# EasyEDA Pro project ProPrj_FOC_AT32F413.epro, board PCB1_1
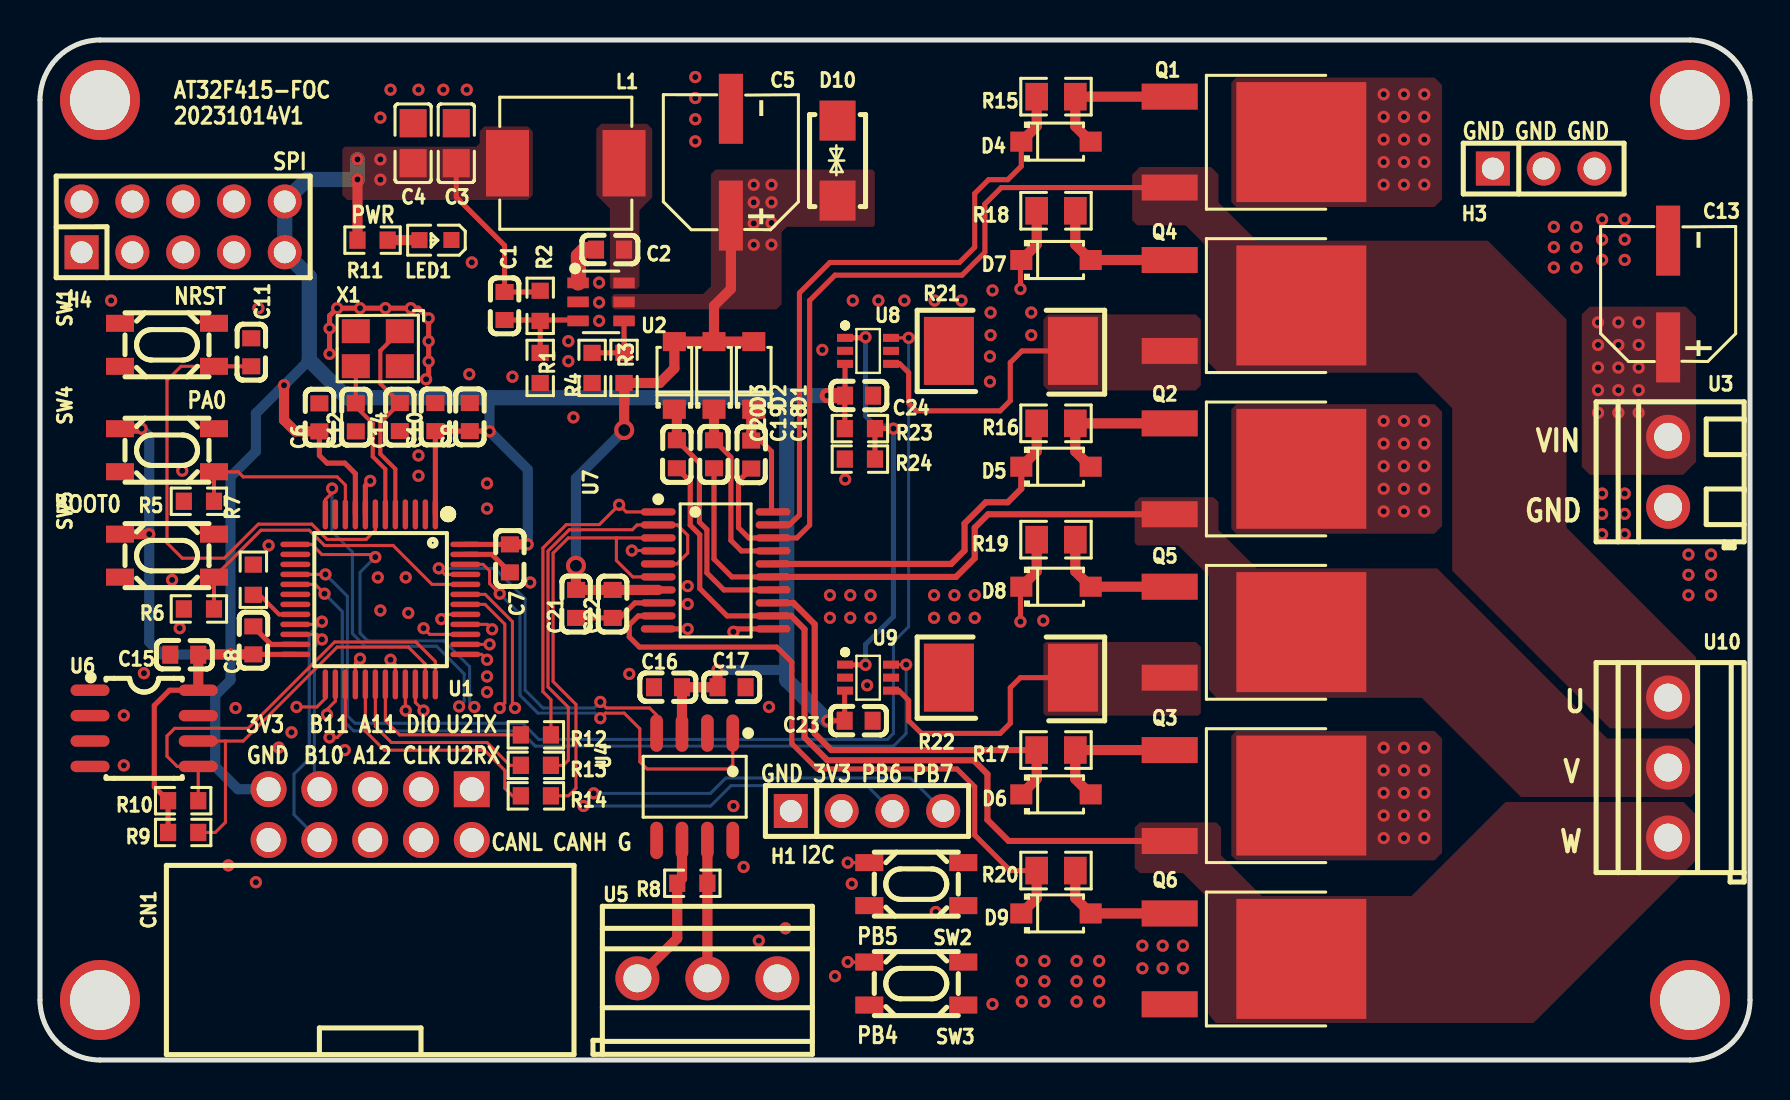
[diagram p11: board, top side]
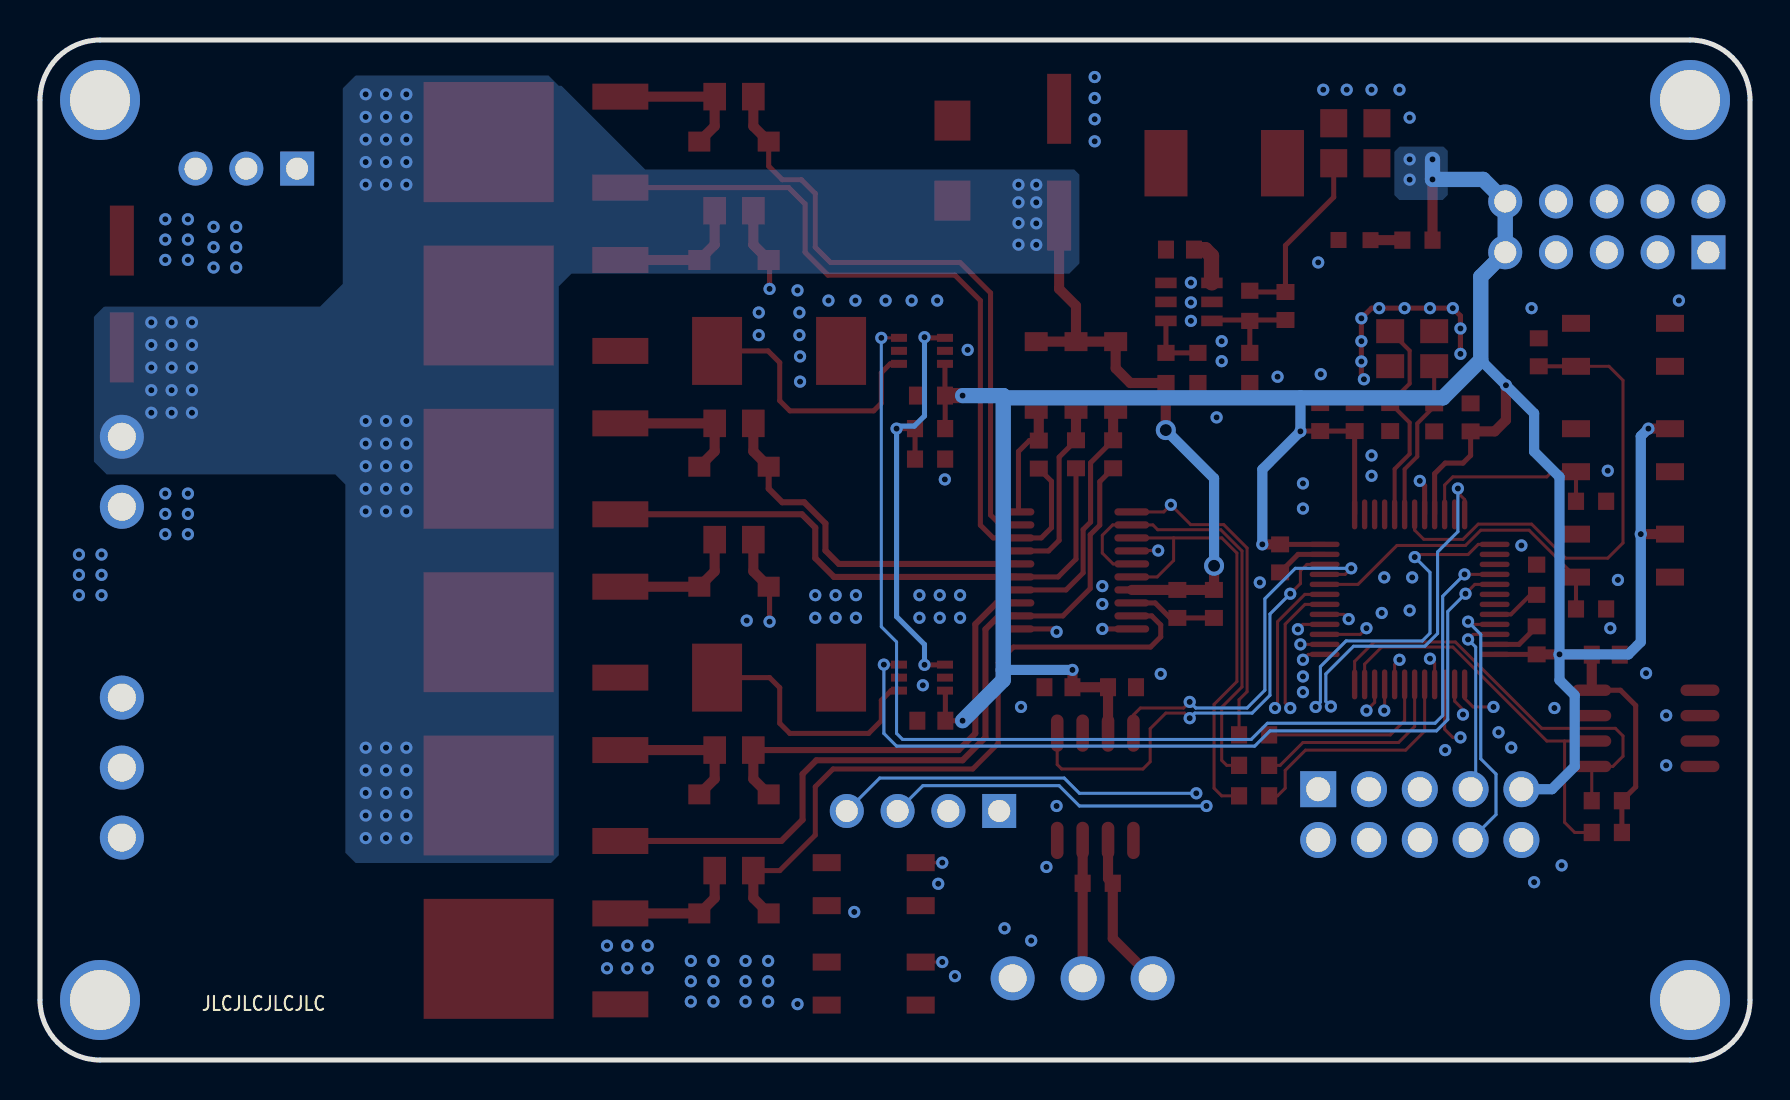
[diagram p12: board, bottom side, seen from below]

Outline 85.5 x 51 mm; copper layers: Top Layer, Inner1, Inner2, Bottom Layer. Coordinates in mm from the lower left corner of the outline.
Outline path: 0,48 0,3 arc(0.88,0.88) 3,0 82.5,0 arc(84.62,0.88) 85.5,3 85.5,48 arc(84.62,50.12) 82.5,51 3,51 arc(0.88,50.12) 0,48
Stack: Top Layer 0.035mm 外层铜厚1oz / Dielectric1 0.2104mm 7628 RC49% 8.6mil / Inner1 0.0152mm 内层铜厚 / Dielectric2 1.065mm 1.1mm H/HOZ 含铜 / Inner2 0.0152mm 内层铜厚 / Dielectric3 0.2104mm 7628 RC49% 8.6mil / Bottom Layer 0.035mm 外层铜厚1oz

## Design rules (mm)
template: 自定义配置
spacing copperThickness1oz (default): track to track 0.102, other pairs 0.152 to 0.3
spacing copperThickness2oz: track to track 0.203, other pairs 0.152 to 0.3
spacing copperThicknessInner0.5oz: track to track 0.089, other pairs 0.152 to 0.3
track width copperThickness1oz (default): min 0.102, default 0.254, max 2.54
track width copperThickness2oz: min 0.203, default 0.254, max 2.54
track width copperThickness0.5oz: min 0.089, default 0.254, max 2.54
differential pair differentialPair (default): width min 0.127, default 0.254, max 2.54; gap min 0.152, default 0.152
via viaSize (default): diameter min 0.3, default 0.61, max 10; hole min 0.201, default 0.305, max 6.299

## Placement (name value [footprint] x y rotation side)
C1  22pF  [C0603]  23.23 37.7 270 top
C2  22nF  [C0603]  28.5 40.52 0 top
C3  22uF  [C0805]  20.81 45.84 270 top
C4  22uF  [C0805]  18.66 45.84 270 top
C5  100uF  [CAP-SMD_BD6.3-L6.6-W6.6-LS7.2-FD]  34.54 44.89 90 top
C6  100nF  [C0603]  13.97 32.13 270 top
C7  100nF  [C0603]  23.5 25.08 90 top
C8  100nF  [C0603]  10.67 20.98 270 top
C9  1uF  [C0603]  21.49 32.15 270 top
C10  100nF  [C0603]  19.77 32.15 270 top
C11  100nF  [C0603]  10.56 35.39 270 top
C12  22pF  [C0603]  15.79 32.13 270 top
C13  100uF  [CAP-SMD_BD6.3-L6.6-W6.6-LS7.2-FD]  81.41 38.3 90 top
C14  22pF  [C0603]  17.99 32.15 90 top
C15  100nF  [C0603]  7.21 20.27 180 top
C16  10uF  [C0603]  31.4 18.64 0 top
C17  100nF  [C0603]  34.58 18.64 180 top
C18  100nF  [C0603]  35.56 30.27 90 top
C19  100nF  [C0603]  33.7 30.29 90 top
C20  100nF  [C0603]  31.84 30.29 90 top
C21  1uF  [C0603]  26.81 22.8 90 top
C22  100nF  [C0603]  28.63 22.8 90 top
C23  100nF  [C0603]  40.93 16.96 0 top
C24  100nF  [C0603]  40.95 33.22 0 top
CN1  Z-231012810106  [IDC-TH_Z-231012810106]  16.51 12.27 180 top
D1  DSK34  [SOD-123_L2.8-W1.8-LS3.7-RD]  35.69 34.23 90 top
D2  DSK34  [SOD-123_L2.8-W1.8-LS3.7-RD]  33.7 34.23 90 top
D3  DSK34  [SOD-123_L2.8-W1.8-LS3.7-RD]  31.72 34.23 90 top
D4  1N4148W  [SOD-123F_L2.7-W1.6-LS3.8-RD]  50.8 45.92 0 top
D5  1N4148W  [SOD-123F_L2.7-W1.6-LS3.8-RD]  50.8 29.66 0 top
D6  1N4148W  [SOD-123F_L2.7-W1.6-LS3.8-RD]  50.8 13.28 0 top
D7  1N4148W  [SOD-123F_L2.7-W1.6-LS3.8-RD]  50.8 40 0 top
D8  1N4148W  [SOD-123F_L2.7-W1.6-LS3.8-RD]  50.8 23.66 0 top
D9  1N4148W  [SOD-123F_L2.7-W1.6-LS3.8-RD]  50.8 7.33 0 top
D10  SMAJ12CA/TR13  [SMA_L4.4-W2.6-LS5.0-BI]  39.88 44.97 270 top
H1  X6511WV-04H-C60D30  [HDR-TH_4P-P2.54-V-M]  41.35 12.45 0 top
H3  X6511WV-03H-C30D60  [HDR-TH_3P-P2.54-V-M]  75.18 44.57 0 top
H4  PZ254-2-05-Z-8.5  [HDR-TH_10P-P2.54-V-M-R2-C5-S2.54]  7.16 41.66 0 top
L1  6.8uH  [IND-SMD_L7.1-W6.6]  26.29 44.84 180 top
LED1  XL-1608UBC-04  [LED0603-RD_BLUE]  19.77 41 180 top
NOREF  -  [Pad_e7601]  3 3 0 top
NOREF#2  -  [Pad_e7602]  3 48 0 top
NOREF#3  -  [Pad_e7600]  82.5 3 0 top
NOREF#4  -  [Pad_e67]  82.5 48 0 top
Q1  NCE3080K  [TO-252-2_L6.6-W6.1-P4.57-LS9.9-TL-CW]  59.78 45.89 0 top
Q2  NCE3080K  [TO-252-2_L6.6-W6.1-P4.57-LS9.9-TL-CW]  59.78 29.56 0 top
Q3  NCE3080K  [TO-252-2_L6.6-W6.1-P4.57-LS9.9-TL-CW]  59.78 13.22 0 top
Q4  NCE3080K  [TO-252-2_L6.6-W6.1-P4.57-LS9.9-TL-CW]  59.78 37.73 0 top
Q5  NCE3080K  [TO-252-2_L6.6-W6.1-P4.57-LS9.9-TL-CW]  59.78 21.39 0 top
Q6  NCE3080K  [TO-252-2_L6.6-W6.1-P4.57-LS9.9-TL-CW]  59.78 5.06 0 top
R1  22.1kΩ  [R0603]  25.01 34.6 270 top
R2  100kΩ  [R0603]  25.01 37.71 270 top
R3  20kΩ  [R0603]  29.2 34.6 270 top
R4  10kΩ  [R0603]  27.6 34.6 90 top
R5  10kΩ  [R0603]  7.95 27.94 0 top
R6  10kΩ  [R0603]  7.95 22.55 0 top
R7  10kΩ  [R0603]  10.67 24.01 270 top
R8  120Ω  [R0603]  32.62 8.84 180 top
R9  10kΩ  [R0603]  7.16 11.38 180 top
R10  10kΩ  [R0603]  7.16 12.97 180 top
R11  1kΩ  [R0603]  16.63 40.99 0 top
R12  100Ω  [R0603]  24.79 16.26 0 top
R13  100Ω  [R0603]  24.79 14.73 0 top
R14  100Ω  [R0603]  24.79 13.21 0 top
R15  10Ω  [R0805_NEW]  50.8 48.17 0 top
R16  10Ω  [R0805_NEW]  50.8 31.83 0 top
R17  10Ω  [R0805_NEW]  50.8 15.5 0 top
R18  10Ω  [R0805_NEW]  50.8 42.46 0 top
R19  10Ω  [R0805_NEW]  50.8 26.02 0 top
R20  10Ω  [R0805_NEW]  50.8 9.47 0 top
R21  5mΩ  [RES-SMD_L6.4-W3.2-1]  48.55 35.45 0 top
R22  5mΩ  [RES-SMD_L6.4-W3.2-1]  48.55 19.12 0 top
R23  1kΩ  [R0603]  41 31.57 0 top
R24  1kΩ  [R0603]  41 30.05 180 top
SW1  TS-1145A-B-A  [SW-SMD_4P-L4.2-W3.2-P2.15-LS5.2]  6.35 35.76 270 top
SW2  TS-1145A-B-A  [SW-SMD_4P-L4.2-W3.2-P2.15-LS5.2]  43.81 8.79 90 top
SW3  TS-1145A-B-A  [SW-SMD_4P-L4.2-W3.2-P2.15-LS5.2]  43.81 3.82 90 top
SW4  TS-1145A-B-A  [SW-SMD_4P-L4.2-W3.2-P2.15-LS5.2]  6.35 30.49 270 top
SW5  TS-1145A-B-A  [SW-SMD_4P-L4.2-W3.2-P2.15-LS5.2]  6.35 25.22 270 top
U1  AT32F415CBT7  [LQFP-48_L7.0-W7.0-P0.50-LS9.0-BL]  17.02 23.03 180 top
U2  MT2492  [SOT-23-6_L2.9-W1.6-P0.95-LS2.8-BL]  28.05 37.91 270 top
U3  KF128L-3.5-2P  [CONN-TH_P3.50_KF128L-3.5-2P]  81.41 29.41 90 top
U4  SIT65HVD230DR  [SOP-8_L4.9-W3.9-P1.27-LS6.0-BL]  32.73 13.66 180 top
U5  KF128L-3.5-3P  [CONN-TH_3P-P3.50_KF128L-3.5-3P]  33.37 4.08 0 top
U6  AT24C02C-SSHM-T  [SOIC-8_L5.0-W4.0-P1.27-LS6.0-BL]  5.21 16.58 270 top
U7  EG2133  [TSSOP-20_L6.5-W4.4-P0.65-LS6.4-BL]  33.78 24.48 270 top
U8  TP181A1-CR  [SC70-6_L2.1-W1.3-P0.65-LS2.3-BL]  41.4 35.46 270 top
U9  TP181A1-CR  [SC70-6_L2.1-W1.3-P0.65-LS2.3-BL]  41.4 19.12 270 top
U10  KF128L-3.5-3P  [CONN-TH_3P-P3.50_KF128L-3.5-3P]  81.41 14.62 90 top
X1  8MHz  [OSC-SMD_4P-L3.2-W2.5-BL]  16.89 35.57 180 top

## Footprints (pads in the part's own frame, mm; a bottom-side part is the same pattern mirrored in y, then rotated)
C0603
  rect 0.8x0.9 smd: 1(-0.7,0) 2(0.7,0)
C0805
  rect 1.41x1.35 smd: 1(-1,0) 2(1,0)
CAP-SMD_BD6.3-L6.6-W6.6-LS7.2-FD
  rect 3.5x1.2 smd: 1(-2.67,0) 2(2.67,0)
CONN-TH_3P-P3.50_KF128L-3.5-3P
  round 2.2 hole 1.4: 1(-3.5,0) 2(0,0) 3(3.5,0)
CONN-TH_P3.50_KF128L-3.5-2P
  round 2.2 hole 1.4: 1(-1.75,0) 2(1.75,0)
HDR-TH_3P-P2.54-V-M
  rect 1.7x1.7 hole 1.1: 1(-2.54,0)
  round 1.7 hole 1.1: 2(0,0) 3(2.54,0)
HDR-TH_4P-P2.54-V-M
  rect 1.7x1.7 hole 1.1: 1(-3.81,0)
  round 1.7 hole 1.1: 2(-1.27,0) 3(1.27,0) 4(3.81,0)
HDR-TH_10P-P2.54-V-M-R2-C5-S2.54
  rect 1.7x1.7 hole 1.1: 1(-5.08,-1.27)
  round 1.7 hole 1.1: 2(-5.08,1.27) 3(-2.54,-1.27) 4(-2.54,1.27) 5(0,-1.27) 6(0,1.27) 7(2.54,-1.27) 8(2.54,1.27) 9(5.08,-1.27) 10(5.08,1.27)
IDC-TH_Z-231012810106
  rect 1.8x1.8 hole 1.2: 1(-5.08,-1.27)
  round 1.8 hole 1.2: 2(-5.08,1.27) 3(-2.54,-1.27) 4(-2.54,1.27) 5(0,-1.27) 6(0,1.27) 7(2.54,-1.27) 8(2.54,1.27) 9(5.08,-1.27) 10(5.08,1.27)
IND-SMD_L7.1-W6.6
  rect 2.15x3.32 smd: 1(-2.913,0) 2(2.913,0)
LED0603-RD_BLUE
  rect 0.8x0.8 smd: 1(-0.799,-0.004) 2(0.799,0.004)
LQFP-48_L7.0-W7.0-P0.50-LS9.0-BL
  oval 0.27x1.5 smd: 1(-2.75,-4.25) 2(-2.25,-4.25) 3(-1.75,-4.25) 4(-1.25,-4.25) 5(-0.75,-4.25) 6(-0.25,-4.25) 7(0.25,-4.25) 8(0.75,-4.25) 9(1.25,-4.25) 10(1.75,-4.25) 11(2.25,-4.25) 12(2.75,-4.25) 25(2.75,4.25) 26(2.25,4.25) 27(1.75,4.25) 28(1.25,4.25) 29(0.75,4.25) 30(0.25,4.25) 31(-0.25,4.25) 32(-0.75,4.25) 33(-1.25,4.25) 34(-1.75,4.25) 35(-2.25,4.25) 36(-2.75,4.25)
  oval 1.5x0.27 smd: 13(4.25,-2.75) 14(4.25,-2.25) 15(4.25,-1.75) 16(4.25,-1.25) 17(4.25,-0.75) 18(4.25,-0.25) 19(4.25,0.25) 20(4.25,0.75) 21(4.25,1.25) 22(4.25,1.75) 23(4.25,2.25) 24(4.25,2.75) 37(-4.25,2.75) 38(-4.25,2.25) 39(-4.25,1.75) 40(-4.25,1.25) 41(-4.25,0.75) 42(-4.25,0.25) 43(-4.25,-0.25) 44(-4.25,-0.75) 45(-4.25,-1.25) 46(-4.25,-1.75) 47(-4.25,-2.25) 48(-4.25,-2.75)
OSC-SMD_4P-L3.2-W2.5-BL
  rect 1.4x1.2 smd: 1(-1.1,-0.875) 2(1.1,-0.875) 3(1.1,0.875) 4(-1.1,0.875)
Pad_e67
  round 4 hole 3: 2(0,0)
Pad_e7600
  round 4 hole 3: 2(0,0)
Pad_e7601
  round 4 hole 3: 2(0,0)
Pad_e7602
  round 4 hole 3: 2(0,0)
R0603
  rect 0.806x0.864 smd: 1(-0.753,0) 2(0.753,0)
R0805_NEW
  rect 1.133x1.377 smd: 1(-0.966,0) 2(0.966,0)
RES-SMD_L6.4-W3.2-1
  rect 2.5x3.4 smd: 1(-3.1,0) 2(3.1,0)
SC70-6_L2.1-W1.3-P0.65-LS2.3-BL
  rect 0.4x0.8 smd: 1(-0.65,-1.15) 2(-0.001,-1.15) 3(0.65,-1.15) 4(0.65,1.15) 5(0,1.15) 6(-0.65,1.15)
SMA_L4.4-W2.6-LS5.0-BI
  rect 2x1.8 smd: 1(-2,0) 2(2,0)
SOD-123_L2.8-W1.8-LS3.7-RD
  rect 0.95x1.15 smd: 1(-1.692,0) 2(1.692,0)
SOD-123F_L2.7-W1.6-LS3.8-RD
  rect 1.1x1 smd: 1(-1.735,0) 2(1.735,0)
SOIC-8_L5.0-W4.0-P1.27-LS6.0-BL
  oval 0.569x1.95 smd: 1(-1.905,-2.705) 2(-0.635,-2.705) 3(0.635,-2.705) 4(1.905,-2.705) 5(1.905,2.705) 6(0.635,2.705) 7(-0.635,2.705) 8(-1.905,2.705)
SOP-8_L4.9-W3.9-P1.27-LS6.0-BL
  oval 0.63x1.865 smd: 1(-1.905,-2.683) 2(-0.635,-2.683) 3(0.635,-2.683) 4(1.905,-2.683) 5(1.905,2.683) 6(0.635,2.683) 7(-0.635,2.683) 8(-1.905,2.683)
SOT-23-6_L2.9-W1.6-P0.95-LS2.8-BL
  rect 0.532x1.072 smd: 1(-0.95,-1.149) 2(0,-1.149) 3(0.95,-1.149) 4(0.95,1.149) 5(0,1.149) 6(-0.95,1.149)
SW-SMD_4P-L4.2-W3.2-P2.15-LS5.2
  rect 0.85x1.4 smd: 1(1.075,2.35) 2(1.075,-2.35) 3(-1.075,2.35) 4(-1.075,-2.35)
TO-252-2_L6.6-W6.1-P4.57-LS9.9-TL-CW
  rect 2.8x1.3 smd: 1(-3.292,2.273) 3(-3.292,-2.273)
  rect 6.5x6 smd: 2(3.292,0)
TSSOP-20_L6.5-W4.4-P0.65-LS6.4-BL
  oval 0.364x1.742 smd: 1(-2.925,-2.871) 2(-2.275,-2.871) 3(-1.625,-2.871) 4(-0.975,-2.871) 5(-0.325,-2.871) 6(0.325,-2.871) 7(0.975,-2.871) 8(1.625,-2.871) 9(2.275,-2.871) 10(2.925,-2.871) 11(2.925,2.871) 12(2.275,2.871) 13(1.625,2.871) 14(0.975,2.871) 15(0.325,2.871) 16(-0.325,2.871) 17(-0.975,2.871) 18(-1.625,2.871) 19(-2.275,2.871) 20(-2.925,2.871)

## Nets
As in the schematic, except:
GND: C3.1 C4.1 C5.2 C6.1 C7.1 C8.1 C9.1 C10.1 C11.1 C12.2 C13.2 C14.1 C15.2 C16.1 C17.1 C21.1 C22.1 C23.2 C24.2 CN1.10 D10.1 H1.1 H3.1 H3.2 H3.3 H4.7 H4.8 LED1.1 NOREF.2 NOREF#2.2 NOREF#3.2 NOREF#4.2 Q6.3 R1.2 R4.1 R5.1 R6.1 R7.1 R21.1 R22.1 R24.2 SW1.4 SW2.4 SW3.4 U1.8 U1.23 U1.47 U2.2 U3.1 U4.2 U4.8 U5.3 U6.1 U6.2 U6.3 U6.4 U6.7 U7.8 U8.2 U8.5 U9.2 U9.5 X1.2 X1.4

Pads without a net: SW1 2 3; SW2 2 3; SW3 2 3; SW4 2 3; SW5 2 3; U1 2 3 4 11 14 15 18 19; U4 5

## Via types
v1: diameter 0.61, hole 0.305, Top Layer to Bottom Layer, 259 vias
v2: diameter 1, hole 0.6, Top Layer to Bottom Layer, 2 vias

## Routing (per net, layer and track width the routed paths; a pad name or vN(x,y) marks a point on that pad's centre or on a via; arc(x,y) is an arc through that point)
3V3: length 175.5
  Top Layer w0.254: 6.41,11.38 6.41,12.97 5.72,13.66 5.72,17.73 6.48,18.49 U6.8 ; C3.2 20.81,43.14 23.23,40.73 C1.1 24.95,38.4 R2.1 ; U1.24 C8.2 ; v1(39.37,16.96) C23.1 40.23,18.45 U9.3 ; U1.1 C10.2 C9.2 22.46,31.45 v1(22.48,31.43) ; U1.9 15.77,29.32 15.24,29.84 14.35,29.84 13.97,30.23 C6.2 ; R23.1 40.24,33.21 C24.1 U8.3 ; U1.48 C7.2
  Top Layer w0.508: v1(5.08,31.57) 4,31.57 SW4.4 ; R11.1 v1(15.88,44.03) ; U4.3 C16.2 C17.2 v1(33.88,19.5) ; C7.2 v1(24.38,25.78) ; C6.2 12.76,31.43 12.2,31.99 v1(12.2,33.74) ; U6.8 C15.1 7.93,20.28 v1(9.52,20.28) C8.2 ; 4,26.29 v1(5.46,26.29)
  Top Layer w0.762: v1(39.37,33.22) C24.1
  Inner2 w0.762: v1(39.37,16.96) 39.37,13.16 H1.2
  Bottom Layer w0.508: 13.46,35 v1(12.2,33.74) 10.8,32.33 10.8,30.43 9.52,29.16 v1(9.52,20.28) ; v1(33.88,19.5) 37.34,19.5 ; CN1.9 9.9,13.54 8.76,14.68 8.76,18.23 9.52,19 v1(9.52,20.28) ; v1(9.52,20.28) 6.08,20.28 5.46,20.9 v1(5.46,26.29) 5.46,31.19 v1(5.08,31.57) ; v1(24.38,25.78) 24.38,29.53 v1(22.48,31.43) 22.48,33.11
  Bottom Layer w0.762: v1(15.88,45.03) v1(15.88,44.03) 13.34,44.03 H4.10 12.24,40.39 13.46,39.16 13.46,35 15.35,33.11 37.23,33.11 37.34,33.22 ; 37.34,33.22 v1(39.37,33.22) ; 37.34,33.22 37.34,19 v1(39.37,16.96)
  vias: v1(17.02,45.03) v1(17.02,44.02)
3V3EN: length 3.2
  Top Layer w0.254: U2.4 R3.1 R4.2
GND: length 21.6
  Top Layer w0.254: U7.8 29.74,22.85 28.99,22.1 C22.1 C21.1 ; v1(14.48,35.31) v1(14.48,36.58) 14.48,37.21 v1(14.86,37.59) v1(16,37.59) v1(17.27,37.59) v1(18.54,37.59) 18.92,37.59 v1(19.43,37.08) v1(19.43,35.94) v1(19.43,34.92) 19.43,34.16 v1(19.3,34.04) ; U1.47 22.59,25.28 C7.1 ; U1.23 11.55,20.78 10.67,21.66 C8.1 ; U1.8 16.27,28.71 v1(16.51,28.96)
  vias: v1(3.56,37.97) v1(4.19,17.23) v1(4.19,14.73) v1(5.2,19.34) v1(6.6,24) v1(6.98,21.59) v1(7.11,29.46) v1(9.42,9.73) v1(9.78,17.6) v1(10.8,8.89) v1(10.92,37.59) v1(11.43,25.73) v1(11.94,15.62) v1(12.57,16.38) v1(15.24,15.49) v1(16.89,24.13) v1(17.02,47.12) v1(17.02,22.48) v1(17.53,48.51) v1(18.29,24.13) v1(18.41,22.35) v1(18.92,48.51) v1(18.92,30.23) v1(18.92,29.21) v1(20.16,48.51) v1(21.34,48.51) v1(21.46,34.29) v1(21.59,39.88) v1(22.35,28.83) v1(22.35,27.57) v1(22.35,19.18) v1(22.35,18.39) v1(23.62,34.16) v1(24.51,23.88) v1(26.42,35.94) v1(26.42,34.94) v1(26.67,32.13) v1(27.96,38.87) v1(27.96,37.88) v1(27.96,36.96) v1(29.46,19.3) v1(32.38,23.7) v1(32.38,22.8) v1(32.77,49.15) v1(32.77,48.1) v1(32.77,47.04) v1(32.77,45.93) v1(34.67,12.7) v1(35.18,9.65) v1(35.94,5.97) v1(36.45,17.65) v1(37.27,6.58) v1(39.12,35.51) v1(39.5,23.24) v1(39.5,22.11) v1(39.75,4.19) v1(40.26,29.03) v1(40.51,23.24) v1(40.51,22.11) v1(40.59,8.81) v1(40.64,37.97) v1(41.36,18.74) v1(41.53,23.24) v1(41.53,22.11) v1(41.92,37.97) v1(43.22,37.97) v1(44.73,37.97) v1(44.7,23.24) v1(44.7,22.11) v1(44.79,7.4) v1(45.72,23.24) v1(45.72,22.11) v1(46.08,37.97) v1(46.74,23.24) v1(46.74,22.11) v1(47.5,35.18) v1(47.5,33.92) v1(47.53,37.37) v1(47.53,36.24) v1(47.62,38.48) v1(47.62,2.79) v1(49.09,4.95) v1(49.09,3.94) v1(49.09,2.92) v1(49.56,37.37) v1(49.56,36.24) v1(50.16,21.97) v1(50.22,4.95) v1(50.22,3.94) v1(50.22,2.92) v1(51.83,4.95) v1(51.83,3.94) v1(51.83,2.92) v1(52.96,4.95) v1(52.96,3.94) v1(52.96,2.92) v1(55.12,5.72) v1(55.12,4.59) v1(56.13,5.72) v1(56.13,4.59) v1(57.15,5.72) v1(57.15,4.59) v1(75.69,41.66) v1(75.69,40.64) v1(75.69,39.62) v1(76.82,41.66) v1(76.82,40.64) v1(76.82,39.62) v1(78.1,42.04) v1(78.1,41.02) v1(78.1,40) v1(78.1,28.32) v1(78.1,27.31) v1(78.1,26.29) v1(79.23,42.04) v1(79.23,41.02) v1(79.23,40) v1(79.23,28.32) v1(79.23,27.31) v1(79.23,26.29) v1(82.42,25.27) v1(82.42,24.26) v1(82.42,23.24) v1(83.55,25.27) v1(83.55,24.26) v1(83.55,23.24)
VIN: length 30.2
  Top Layer w0.508: D2.2 33.7,37.71 34.54,38.55 C5.1 ; D2.2 D1.2 ; D2.2 D3.2 31.72,34.58 30.98,33.85 R3.2 29.21,33.84 v2(29.21,31.5) ; U7.7 C22.2 C21.2 26.8,23.51 v2(26.8,24.71)
  Bottom Layer w0.508: v2(26.8,24.71) 26.8,29.08 v2(29.21,31.5)
  vias: v1(35.69,43.76) v1(35.69,42.88) v1(35.69,41.83) v1(35.69,40.76) v1(36.58,43.76) v1(36.58,42.88) v1(36.58,41.85) v1(36.58,40.77) v1(67.18,48.29) v1(67.18,47.16) v1(67.18,46.03) v1(67.18,44.9) v1(67.18,43.77) v1(67.18,31.95) v1(67.18,30.82) v1(67.18,29.69) v1(67.18,28.56) v1(67.18,27.43) v1(67.18,15.61) v1(67.18,14.48) v1(67.18,13.36) v1(67.18,12.23) v1(67.18,11.1) v1(68.2,48.29) v1(68.2,47.16) v1(68.2,46.03) v1(68.2,44.9) v1(68.2,43.77) v1(68.2,31.95) v1(68.2,30.82) v1(68.2,29.69) v1(68.2,28.56) v1(68.2,27.43) v1(68.2,15.61) v1(68.2,14.48) v1(68.2,13.36) v1(68.2,12.23) v1(68.2,11.1) v1(69.22,48.29) v1(69.22,47.16) v1(69.22,46.03) v1(69.22,44.9) v1(69.22,43.77) v1(69.22,31.95) v1(69.22,30.82) v1(69.22,29.69) v1(69.22,28.56) v1(69.22,27.43) v1(69.22,15.61) v1(69.22,14.48) v1(69.22,13.36) v1(69.22,12.23) v1(69.22,11.1) v1(77.9,36.88) v1(77.9,35.75) v1(77.9,34.62) v1(77.9,33.49) v1(77.9,32.36) v1(78.92,36.88) v1(78.92,35.75) v1(78.92,34.62) v1(78.92,33.49) v1(78.92,32.36) v1(79.93,36.88) v1(79.93,35.75) v1(79.93,34.62) v1(79.93,33.49) v1(79.93,32.36)
BOOT0: length 16.3
  Top Layer w0.152: SW5.1 11.05,26.49 13.46,26.49 14.22,25.73 17.65,25.73 19.6,23.78 U1.44
  Top Layer w0.203: R6.2 SW5.1
BS: length 2.4
  Top Layer w0.762: C2.1 27.24,40.52 26.92,40.2 26.92,38.88 U2.1
CAN1_RX: length 19.2
  Top Layer w0.152: v1(19.94,24.58) 20.24,24.28 U1.45 ; v1(28.02,17.9) 28.32,17.6 30.48,17.6 30.83,17.25 U4.4
  Bottom Layer w0.152: v1(28.02,17.9) 27.71,17.6 25.15,17.6 24.26,18.49 24.26,23.06 22.73,24.58 v1(19.94,24.58)
CAN1_TX: length 23.2
  Top Layer w0.152: v1(22.99,23.31) 22.48,23.82 22.48,24.46 22.16,24.78 U1.46 ; U4.1 34.64,14.77 34.42,14.55 30.35,14.55 29.99,14.91 29.99,16.56 29.21,17.34 28.27,17.34 v1(28.02,17.09)
  Bottom Layer w0.152: v1(28.02,17.09) 27.76,17.34 24.89,17.34 24,18.23 24,22.3 v1(22.99,23.31)
CANH: length 6.9
  Top Layer w0.508: U4.7 R8.1 U5.2
CANL: length 7.8
  Top Layer w0.508: U4.6 32.1,9.07 R8.2 31.86,6.08 U5.1
EEPROM_SCL: length 20.3
  Top Layer w0.152: U1.35 19.27,19.79 18.41,20.65 14.86,20.65 10.16,15.95 9.27,15.95 ; 9.27,15.95 9.27,11.88 8.76,11.38 R9.1 ; 9.27,15.95 7.91,15.95
EEPROM_SDA: length 21.4
  Top Layer w0.152: U1.36 19.77,19.93 18.8,20.9 14.73,20.9 10.41,16.58 6.73,16.58 6.35,16.2 6.35,15.19 6.86,14.68 U6.5 R10.1
FB: length 5.3
  Top Layer w0.254: C1.2 26.86,37 U2.3 ; R1.1 R2.2
M0_HO1: length 31.7
  Top Layer w0.254: D4.1 49.06,44.69 48.39,44.02 47.43,44.02 46.74,43.32 46.74,40.64 45.97,39.88 39.5,39.88 37.97,38.35 37.97,27.25 37.48,26.75 36.65,26.75
  Top Layer w0.508: R15.1 49.83,46.69 D4.1
M0_HO2: length 18.3
  Top Layer w0.305: D5.1 49.06,28.56 48.39,27.89 47.29,27.89 46.23,26.83 46.23,25.47 45.56,24.8 36.65,24.8
  Top Layer w0.508: R16.1 49.83,30.43 D5.1
M0_HO3: length 22
  Top Layer w0.305: R17.1 39.57,15.5 38.73,16.33 38.73,21.79 37.67,22.85 36.65,22.85
  Top Layer w0.508: R17.1 49.83,14.05 D6.1
M0_IN1: length 20.2
  Top Layer w0.152: R12.2 25.55,18.01 25.15,18.42 25.15,25.6 26.31,26.77 27.97,26.77 v1(28.96,27.76) 29.31,27.4 U7.1 ; v1(29.59,25.47) 30.89,25.47 U7.4
  Inner2 w0.152: v1(29.59,25.47) 29.59,27.12 v1(28.96,27.76)
M0_IN2: length 22.2
  Top Layer w0.152: R13.2 26.16,14.73 26.42,14.99 26.42,17.64 25.4,18.65 25.4,25.45 26.46,26.51 29.62,26.51 29.86,26.75 U7.2 31.87,26.75 32.38,26.23 32.38,25.35 31.84,24.8 U7.5
M0_IN3: length 22.8
  Top Layer w0.152: 28.82,26.1 28.82,24.97 29.64,24.15 U7.6 ; 28.82,26.1 26.41,26.1 25.65,25.35 25.65,18.92 26.8,17.78 26.8,13.59 26.42,13.21 R14.2 ; 28.82,26.1 U7.3
M0_IN_IU: length 13.3
  Top Layer w0.254: U8.4 42.99,34.81 43.43,34.36 43.43,32.84 43.81,32.46 48.01,32.46 48.51,32.97 48.51,34.87 49.1,35.45 R21.2
M0_IN_IV: length 12.8
  Top Layer w0.254: U9.4 42.95,18.47 43.43,17.98 43.43,16.96 44.07,16.33 48.01,16.33 48.51,16.84 48.51,18.61 49.02,19.12 R22.2
M0_IU: length 57.9
  Top Layer w0.152: U8.6 v1(43.43,36.11) ; v1(14.27,24.28) U1.16
  Bottom Layer w0.152: v1(43.43,36.11) 43.43,21.66 42.67,20.9 42.67,16.33 42.37,16.03 24.94,16.03 24.13,16.84 15.75,16.84 15.37,17.22 15.37,23.19 v1(14.27,24.28)
M0_IV: length 41.5
  Top Layer w0.152: v1(14.22,23.31) 13.76,23.78 U1.17 ; U9.6 v1(43.31,19.77)
  Bottom Layer w0.152: v1(14.22,23.31) 15.11,22.42 15.11,17.02 15.67,16.46 24,16.46 24.76,15.69 42.67,15.69 43.31,16.33 v1(43.31,19.77)
M0_LO1: length 36.7
  Top Layer w0.254: v1(49.02,38.55) 49.02,39.96 D7.1 ; v1(34.67,21.41) 34.82,21.55 36.65,21.55
  Top Layer w0.508: D7.1 49.83,40.77 R18.1
  Inner2 w0.254: v1(49.02,38.55) 48.26,37.79 48.26,22.42 47.24,21.41 v1(34.67,21.41)
M0_LO2: length 23.4
  Top Layer w0.254: U7.10 v1(32.38,21.55) ; v1(49.02,21.92) 49.02,23.62 D8.1
  Top Layer w0.508: R19.1 49.83,24.43 D8.1
  Inner2 w0.254: v1(49.02,21.92) 47.75,20.65 33.29,20.65 v1(32.38,21.55)
M0_LO3: length 33.7
  Top Layer w0.254: R20.1 48.51,9.47 46.74,11.24 46.74,13.66 45.85,14.55 38.86,14.55 37.59,15.82 37.59,19.89 36.83,20.65 29.97,20.65 29.46,21.16 29.46,21.75 29.91,22.2 30.91,22.2
  Top Layer w0.508: D9.1 49.83,8.1 R20.1
M0_UOUT: length 40.2
  Top Layer w0.254: C18.1 34.93,28.93 34.93,26.62 35.44,26.1 37.84,26.1 38.48,26.74 38.48,37.97 39.75,39.24 46.1,39.24 47.24,40.39 47.24,42.8 48.07,43.62 Q1.3
M0_VB1: length 5.9
  Top Layer w0.254: C18.2 36.03,30.97 36.58,30.43 36.58,27.48 36.65,27.4
  Top Layer w0.508: D1.1 35.56,32.41 C18.2
M0_VB2: length 9.2
  Top Layer w0.254: C19.2 34.54,30.14 34.54,25.98 35.07,25.45 36.65,25.45
  Top Layer w0.508: D2.1 C19.2
M0_VB3: length 12.5
  Top Layer w0.254: C20.2 32.97,29.86 32.97,26.89 33.34,26.52 33.34,24.36 34.2,23.5 36.65,23.5
  Top Layer w0.508: D3.1 31.84,32.41 C20.2
M0_VOUT: length 29.9
  Top Layer w0.254: C19.1 33.7,25.05 34.59,24.15 36.65,24.15
  Top Layer w0.305: 36.65,24.15 45.8,24.15 46.74,25.09 46.74,26.62 47.41,27.29 56.48,27.29
M0_VS3: length 39.7
  Top Layer w0.254: C20.1 32.51,28.92 32.51,26.74 32.99,26.27 32.99,23.57 34.36,22.2 36.65,22.2
  Top Layer w0.305: Q3.3 48.43,10.95 47.37,12.01 47.37,14.3 46.68,14.99 39.37,14.99 38.23,16.13 38.23,21.54 37.56,22.2 36.65,22.2
NRST: length 25.4
  Top Layer w0.152: SW1.1 7.05,34.69 6.35,33.98 6.35,25.85 7.11,25.09 9.22,25.09 10.92,26.79 13.59,26.79 14.35,26.03 16.31,26.03 16.77,26.49 U1.7
  Top Layer w0.203: SW1.1 C11.2
OSC_IN: length 10.7
  Top Layer w0.203: 17.99,36.44 17.02,35.47 17.02,33.82 C14.2 17.02,31.87 17.02,30.3 17.77,29.55 U1.5
OSC_OUT: length 8
  Top Layer w0.203: X1.3 C12.1 15.79,32.67 16.64,31.82 16.64,30.17 17.27,29.54 U1.6
PA0: length 9.8
  Top Layer w0.152: U1.10 15.27,28.75 14.86,29.16 10.16,29.16 9.9,29.41 SW4.1
  Top Layer w0.203: R5.2 SW4.1
PA2: length 21.7
  Top Layer w0.152: U1.12 14.27,28.02 14.61,28.36 v1(14.61,28.58)
  Inner2 w0.152: CN1.1 21.59,15.88 20.95,16.51 v1(20.95,17.68)
  Bottom Layer w0.152: v1(14.61,28.58) 14.61,26.42 15.62,25.4 15.62,21.32 16.26,20.69 19.83,20.69 21.21,19.3 21.21,17.93 v1(20.95,17.68)
PA3: length 24.5
  Top Layer w0.152: U1.13 13.59,25.78 14.1,25.27 16.64,25.27 v1(16.76,25.15)
  Inner2 w0.152: v1(21.72,17.65) 22.99,16.38 22.99,12.19 21.8,11 CN1.2
  Bottom Layer w0.152: v1(16.76,25.15) 16,24.38 16,21.34 16.38,20.95 20.19,20.95 21.48,19.67 21.48,17.89 v1(21.72,17.65)
PA8: length 12
  Top Layer w0.152: U1.29 16.27,16.44 17.22,15.49 22.22,15.49 23.24,14.48 23.24,13.59 23.62,13.21 R14.1
PA9: length 10.2
  Top Layer w0.152: U1.30 16.77,16.68 17.57,15.88 22.35,15.88 23.5,14.73 R13.1
PA10: length 8.9
  Top Layer w0.152: R12.1 17.98,16.26 17.27,16.97 U1.31
PA11: length 8.2
  Top Layer w0.152: v1(17.53,20.01) 17.77,19.77 U1.32
  Inner2 w0.152: CN1.5 17.53,14.56 v1(17.53,20.01)
PA12: length 8.5
  Top Layer w0.152: v1(18.29,17.47) 18.27,17.49 U1.33
  Inner2 w0.152: v1(18.29,17.47) 17.91,17.09 17.91,12.4 CN1.6
PA13: length 5.5
  Top Layer w0.152: U1.34 18.77,17.88 v1(19.18,17.47)
  Inner2 w0.152: CN1.3 19.18,13.67 v1(19.18,17.47)
PA14: length 12.4
  Top Layer w0.152: v1(22.35,20.01) 22.08,20.28 U1.37
  Inner2 w0.152: v1(22.35,20.01) 20.9,20.01 20.32,19.43 20.32,12.27 CN1.4
PA15: length 30.7
  Top Layer w0.152: U1.38 v1(22.48,20.78)
  Inner2 w0.152: 7.16,40.39 7.16,39.83 10.16,36.83 10.16,31.37 13.34,28.19 13.34,26.54 15.12,24.75 15.12,22.11 15.9,21.34 18.28,21.34 18.83,20.78 v1(22.48,20.78)
PB2: length 2.5
  Top Layer w0.203: U1.20 11.95,22.28 10.98,23.26 R7.2
PB3: length 30.1
  Top Layer w0.152: v1(19.18,21.59) 19.49,21.28 U1.39
  Inner2 w0.152: H4.6 8.51,41.58 8.51,38.99 10.52,36.98 10.52,31.52 13.72,28.32 13.72,26.67 15.62,24.77 15.62,22.48 16.51,21.59 v1(19.18,21.59)
PB4: length 34.3
  Top Layer w0.152: SW3.1 40.39,4.9 ; U1.40 22.36,21.78 v1(22.61,21.54)
  Inner2 w0.152: v1(40.39,4.9) 40.13,4.9 39.85,5.18 39.85,8.99 39.23,9.61 36.74,9.61 35.56,10.8 35.56,12.83 34.42,13.97 25.15,13.97 24.38,14.73 24.38,21.03 23.88,21.54 v1(22.61,21.54)
  Bottom Layer w0.152: 40.39,4.9 v1(40.39,4.9)
PB5: length 32.8
  Top Layer w0.152: v1(20.07,22.04) 20.3,22.28 U1.41 ; SW2.1 v1(40.39,9.87)
  Inner2 w0.152: v1(40.39,9.87) 37,9.87 35.94,10.92 35.94,12.95 34.54,14.35 25.53,14.35 24.76,15.11 24.76,21.41 23.88,22.3 20.32,22.3 v1(20.07,22.04)
PB6: length 31
  Top Layer w0.152: U1.42 22.25,22.78 23.24,21.79 23.24,17.85 v1(22.99,17.6)
  Inner2 w0.152: v1(22.99,17.6) 23.37,17.22 23.37,14.22 24.89,12.7 v1(27.18,12.7)
  Bottom Layer w0.152: v1(27.18,12.7) 33.53,12.7 34.54,13.72 41.36,13.72 H1.3
PB7: length 33.3
  Top Layer w0.152: v1(23.75,17.6) 23.62,17.73 23.62,21.92 22.26,23.28 U1.43
  Inner2 w0.152: v1(27.69,13.34) 24.86,13.34 23.75,14.45 v1(23.75,17.6)
  Bottom Layer w0.152: v1(27.69,13.34) 33.53,13.34 34.29,14.1 43.51,14.1 H1.4
PB10: length 13.4
  Top Layer w0.152: U1.21 13.96,21.78 v1(14.1,21.92)
  Bottom Layer w0.152: CN1.8 12.7,12.27 12.7,14.3 13.46,15.06 13.46,21.28 v1(14.1,21.92)
PB11: length 9.2
  Top Layer w0.152: U1.22 13.84,21.28 v1(14.1,21.03)
  Bottom Layer w0.152: v1(14.1,21.03) 13.72,20.65 13.72,13.79 CN1.7
PB12: length 30.7
  Top Layer w0.152: v1(12.83,17.65) 13.84,17.65 14.27,18.08 U1.25
  Inner2 w0.152: 2.08,40.39 4.36,38.1 6.35,38.1 8.67,35.78 8.67,30.83 11.96,27.53 11.96,18.52 v1(12.83,17.65)
PB13: length 29.7
  Top Layer w0.152: v1(14.35,17.27) 14.35,17.53 14.77,17.94 U1.26
  Inner2 w0.152: 4.62,40.39 4.62,39.58 5.46,38.74 7.03,38.73 9.4,36.37 9.4,31.11 12.7,27.81 12.7,19.94 14.35,18.29 v1(14.35,17.27)
PB14: length 36.3
  Top Layer w0.152: U1.27 15.27,16.54 14.86,16.13 v1(14.48,16.13)
  Inner2 w0.152: H4.2 3.43,41.58 3.43,39.62 4.57,38.48 6.52,38.48 9.03,35.98 9.03,30.98 12.32,27.69 12.32,19.3 13.59,18.03 13.59,17.02 v1(14.48,16.13)
PB15: length 31
  Top Layer w0.152: U1.28 15.77,19.83 v1(16,20.07)
  Inner2 w0.152: v1(16,20.07) 13.59,20.07 13.08,20.57 13.08,27.94 9.78,31.24 9.78,36.55 7.34,38.99 6.35,38.99 5.84,39.5 5.84,41.7 H4.4
VREF: length 22.6
  Top Layer w0.254: v1(41.28,36.14) 41.24,36.11 U8.1 ; R24.1 R23.2 v1(42.67,31.57) ; v1(41.28,19.76) 40.26,19.76 U9.1
  Bottom Layer w0.254: v1(41.28,36.14) 41.28,32.2 41.78,31.7 42.67,31.7 v1(42.67,31.57) 42.67,22.17 41.28,20.77 v1(41.28,19.76)
$1N6913: length 1.6
  Top Layer w0.508: R11.2 LED1.2
$2N1251: length 7.3
  Top Layer w0.508: Q1.1 R15.2 51.77,46.69 D4.2
$2N1356: length 6.7
  Top Layer w0.508: Q4.1 D7.2 51.77,40.77 R18.2
$2N1706: length 7.2
  Top Layer w0.508: 56.48,31.83 R16.2 51.77,30.43 D5.2
$2N1723: length 6.6
  Top Layer w0.508: Q5.1 D8.2 51.77,24.43 R19.2
$2N1987: length 7.3
  Top Layer w0.508: Q3.1 R17.2 51.77,14.05 D6.2
$2N2004: length 6.4
  Top Layer w0.508: Q6.1 D9.2 51.77,8.1 R20.2

## Copper pours and planes (outline as drawn; the poured copper is in the pictures)
3V3 on Top Layer: 15.11,46.68 24.64,46.68 24.64,43 15.11,43
3V3 on Bottom Layer: 15.11,45.67 17.78,45.67 17.78,43 15.11,43
GND on Top Layer: -2.03,54.17 88.26,54.17 88.26,-2.47 -2.03,-2.47
GND on Bottom Layer: -0.13,51.64 90.3,51.64 90.3,-5.01 -0.13,-5.01
GND on Inner1: 0.26,50.74 85.24,50.74 85.24,0.26 0.26,0.26
GND on Inner2: -3.68,55.88 86.74,55.88 86.74,-1.27 -3.68,-1.27
VIN on Top Layer: 59.56,32.79 70.1,32.79 70.1,26.31 59.56,26.31
VIN on Top Layer: 59.56,16.46 70.1,16.46 70.1,9.98 59.56,9.98
VIN on Top Layer: 28.58,44.52 41.74,44.52 41.74,37.54 28.58,37.54
VIN on Top Layer: 77.09,37.67 82.8,37.67 82.8,29.26 77.09,29.26
VIN on Top Layer: 59.56,49.13 70.1,49.13 70.1,42.65 59.56,42.65
VIN on Bottom Layer: 33.53,49.22 82.8,49.22 82.8,9.85 33.53,9.85
VIN on Inner2: 33.53,49.22 82.8,49.22 82.8,9.85 33.53,9.85
M0_IN_IU on Top Layer: 50.16,37.28 58.04,37.28 58.04,33.47 50.16,33.47
M0_IN_IV on Top Layer: 50.16,20.9 58.04,20.9 58.04,17.22 50.16,17.22
M0_UOUT on Top Layer: 54.61,44.65 82.8,44.65 82.8,16.58 54.61,16.58
M0_VOUT on Top Layer: 54.74,28.14 82.8,28.14 82.8,13.15 54.74,13.15
M0_VS3 on Top Layer: 54.74,12.9 82.8,12.9 82.8,1.85 54.74,1.85
SW on Top Layer: 27.81,46.81 30.61,46.81 30.61,38.55 27.81,38.55

Small or netless copper shapes (teardrops, artwork), in the pictures only: 52 on Inner1

## Text on the board
Bottom Silkscreen Layer: JLCJLCJLCJLC
Top Silkscreen Layer: SPI | I2C | BOOT0 | AT32F415-FOC / 20231014V1 | NRST | PA0 | CANL CANH G | GND 3V3 PB6 PB7 | PB5 | PB4 | GND GND GND | 3V3 | GND | B10 | B11 | PWR | A12 | A11 | CLK | DIO | U2TX | U2RX | VIN | W | V | U
